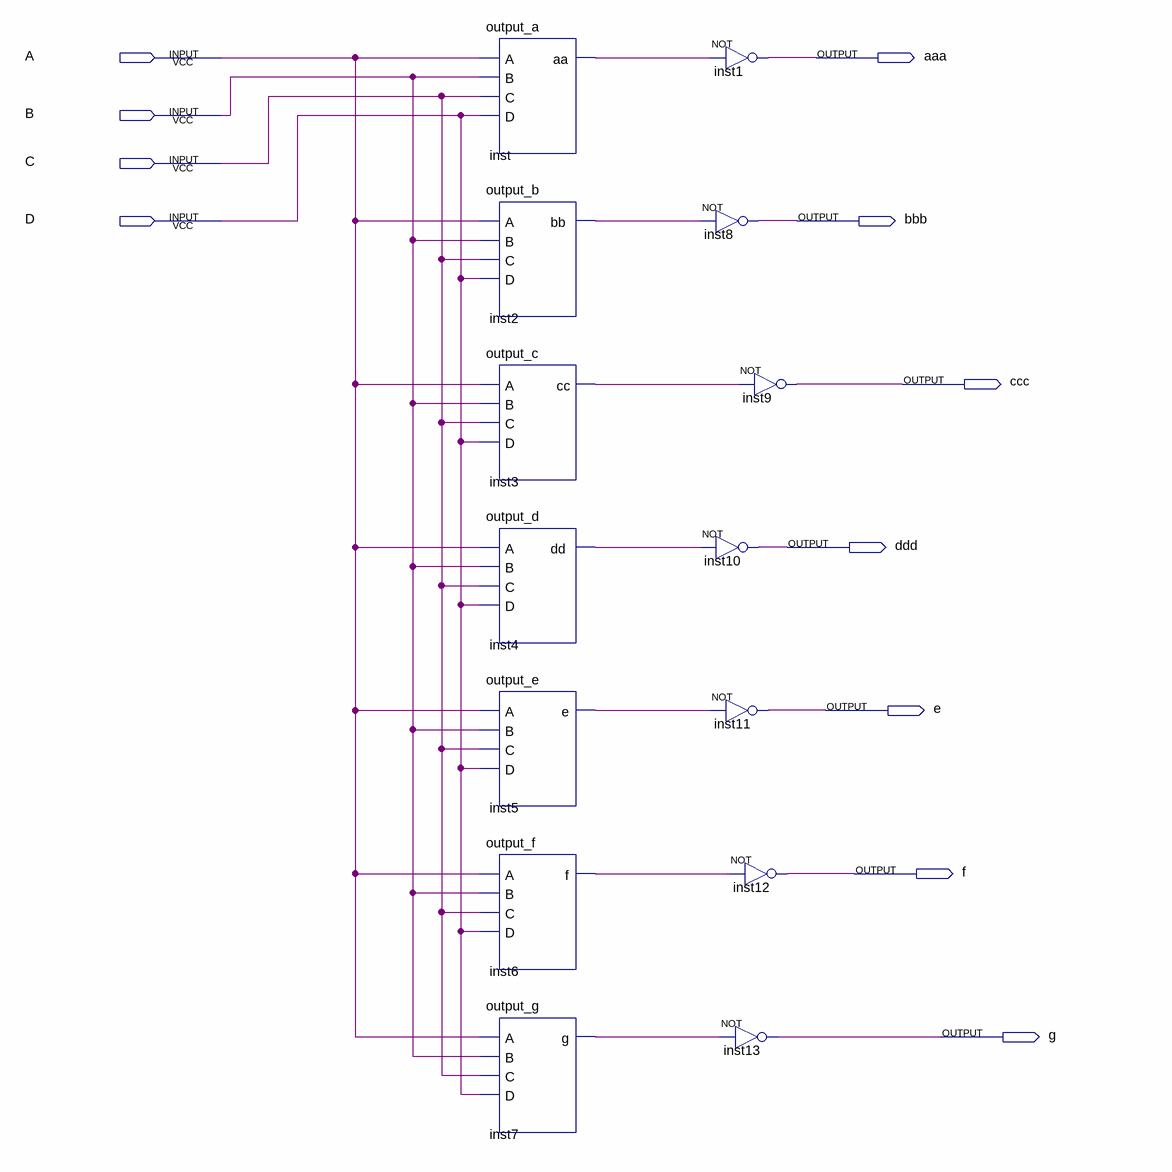
[diagram p0: schematic sheet]
// Quartus schematic BCD_7_Segment_Display_Decoder.bdf as structural Verilog: 14 symbols, 11 pins
module BCD_7_Segment_Display_Decoder (
  input  A,
  input  B,
  input  C,
  input  D,
  output aaa,
  output bbb,
  output ccc,
  output ddd,
  output e,
  output f,
  output g
);

  wire inst2_bb, inst3_cc, inst4_dd, inst5_e, inst6_f, inst7_g, inst_aa;

  output_a inst (.A(A), .B(B), .C(C), .D(D), .aa(inst_aa));
  output_b inst2 (.A(A), .B(B), .C(C), .D(D), .bb(inst2_bb));
  output_c inst3 (.A(A), .B(B), .C(C), .D(D), .cc(inst3_cc));
  output_d inst4 (.A(A), .B(B), .C(C), .D(D), .dd(inst4_dd));
  output_e inst5 (.A(A), .B(B), .C(C), .D(D), .e(inst5_e));
  output_f inst6 (.A(A), .B(B), .C(C), .D(D), .f(inst6_f));
  output_g inst7 (.A(A), .B(B), .C(C), .D(D), .g(inst7_g));
  not inst1 (aaa, inst_aa);
  not inst8 (bbb, inst2_bb);
  not inst10 (ddd, inst4_dd);
  not inst11 (e, inst5_e);
  not inst9 (ccc, inst3_cc);
  not inst12 (f, inst6_f);
  not inst13 (g, inst7_g);
endmodule
